# EAGLE design L3G6_PCB (EAGLE 9.2.0)
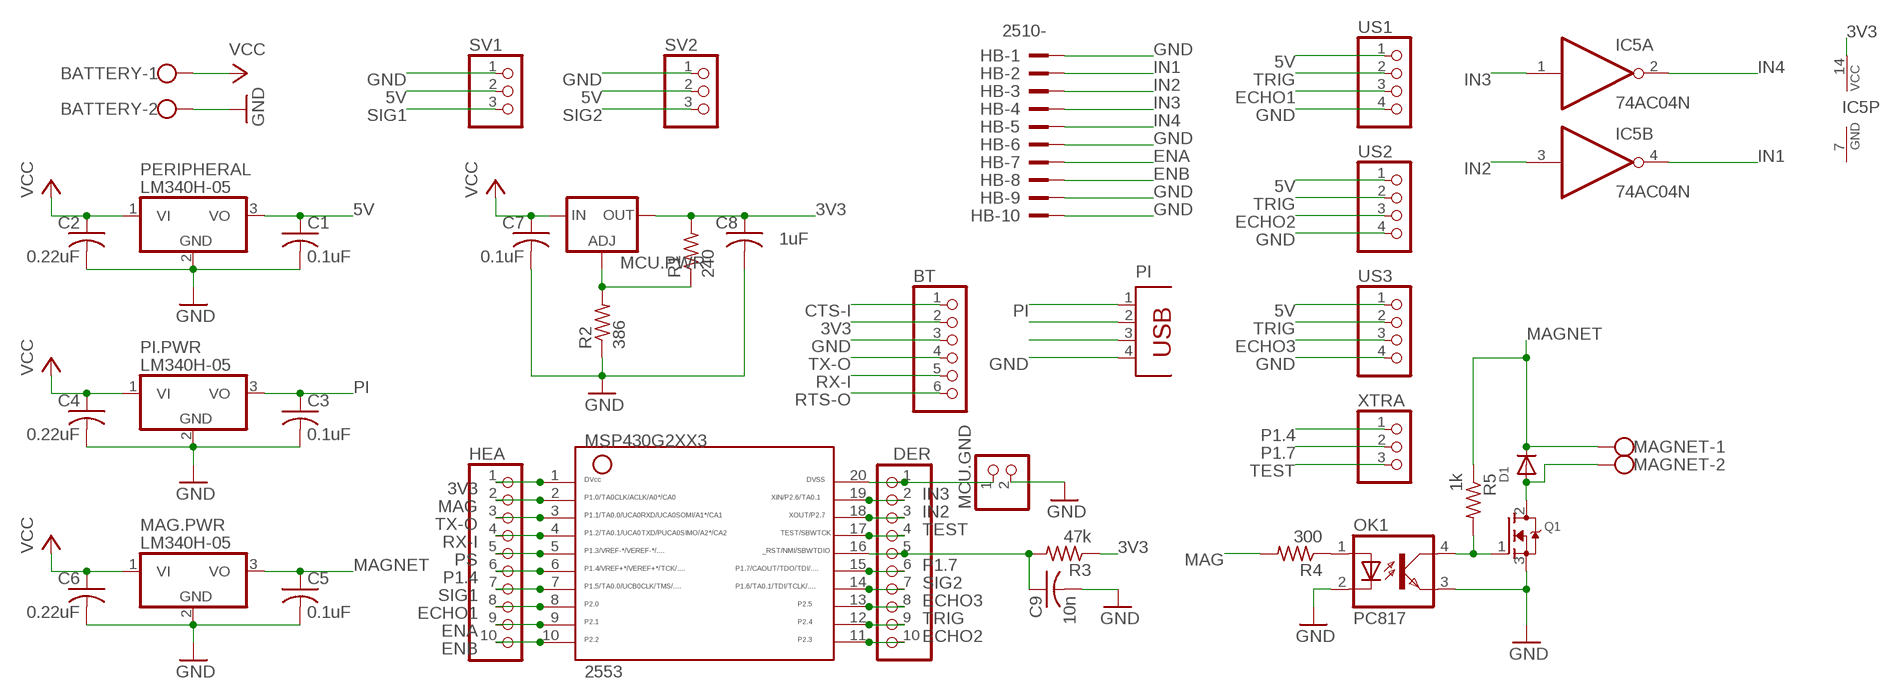
[diagram p0: schematic, sheet 1]

## Parts
2553  G2XX3---N20  [N20]
BATTERY  W237-102  [W237-102]
BT  PINHD-1X6  [1X06]
C1  0.1uF  C-US050-025X075  [C050-025X075]
C2  0.22uF  C-US050-025X075  [C050-025X075]
C3  0.1uF  C-US050-025X075  [C050-025X075]
C4  0.22uF  C-US050-025X075  [C050-025X075]
C5  0.1uF  C-US050-025X075  [C050-025X075]
C6  0.22uF  C-US050-025X075  [C050-025X075]
C7  0.1uF  C-US050-025X075  [C050-025X075]
C8  1uF  C-US050-025X075  [C050-025X075]
C9  10n  C-US050-025X075  [C050-025X075]
D1  DIODEDO-1N4148  [DO-1N4148]
DER  PINHD-1X10  [1X10]
HB  2510-  [PAK100/2500-10]
HEA  PINHD-1X10  [1X10]
IC5  74AC04N  [DIL14]
MAG.PWR  LM340H-05  [TO220H]
MAGNET  W237-102  [W237-102]
MCU.GND  PINHD-1X2  [1X02]
MCU.PWR  LM317TS  [317TS]
OK1  PC817  [DIL04]
PERIPHERAL  LM340H-05  [TO220H]
PI  PN87520  [PN87520]
PI.PWR  LM340H-05  [TO220H]
Q1  MOSFET-NGDS_TO220V  [TO220V]
R1  240  R-US_0207/10  [0207/10]
R2  386  R-US_0207/10  [0207/10]
R3  47k  R-US_0207/10  [0207/10]
R4  300  R-US_0207/10  [0207/10]
R5  1k  R-US_0207/10  [0207/10]
SV1  PINHD-1X3  [1X03]
SV2  PINHD-1X3  [1X03]
US1  PINHD-1X4  [1X04]
US2  PINHD-1X4  [1X04]
US3  PINHD-1X4  [1X04]
XTRA  PINHD-1X3  [1X03]

## Nets
3V3: 2553.1 BT.2 C8.1 HEA.1 IC5.14(P:VCC) MCU.PWR.2(OUT) R1.2 R3.1
5V: C1.1 PERIPHERAL.3(VO) SV1.2 SV2.2 US1.1 US2.1 US3.1
CTS-I: BT.1
ECHO1: 2553.8 HEA.8 US1.3
ECHO2: 2553.11 DER.10 US2.3
ECHO3: 2553.13 DER.8 US3.3
ENA: 2553.9 HB.7 HEA.9
ENB: 2553.10 HB.8 HEA.10
GND: BATTERY.2 BT.3 C1.2 C2.2 C3.2 C4.2 C5.2 C6.2 C7.2 C8.2 C9.2 HB.1 HB.6 HB.9 HB.10 MAG.PWR.2(GND) MCU.GND.2 OK1.2(C) OK1.3(EMIT) PERIPHERAL.2(GND) PI.4 PI.PWR.2(GND) Q1.3(S) R2.1 SV1.1 SV2.1 US1.4 US2.4 US3.4
IN1: HB.2 IC5.4(B:O)
IN2: 2553.18 DER.3 HB.3 IC5.3(B:I)
IN3: 2553.19 DER.2 HB.4 IC5.1(A:I)
IN4: HB.5 IC5.2(A:O)
MAG: 2553.2 HEA.2 R4.2
MAGNET: C5.1 D1.C MAG.PWR.3(VO) MAGNET.1 R5.1
N$1: 2553.16 C9.1 DER.5 R3.2
N$2: MCU.PWR.1(ADJ) R1.1 R2.2
N$3: OK1.1(A) R4.1
N$4: PI.2
N$5: PI.3
N$6: 2553.20 DER.1 MCU.GND.1
N$7: D1.A MAGNET.2 Q1.2(D)
N$8: OK1.4(COL) Q1.1(G) R5.2
P1.4: 2553.6 HEA.6 XTRA.1
P1.7: 2553.15 DER.6 XTRA.2
PI: C3.1 PI.1 PI.PWR.3(VO)
PS: 2553.5 HEA.5
RTS-O: BT.6
RX-I: 2553.4 BT.5 HEA.4
SIG1: 2553.7 HEA.7 SV1.3
SIG2: 2553.14 DER.7 SV2.3
TEST: 2553.17 DER.4 XTRA.3
TRIG: 2553.12 DER.9 US1.2 US2.2 US3.2
TX-O: 2553.3 BT.4 HEA.3
VCC: BATTERY.1 C2.1 C4.1 C6.1 C7.1 MAG.PWR.1(VI) MCU.PWR.3(IN) PERIPHERAL.1(VI) PI.PWR.1(VI)
Unconnected: IC5.5(C:I) IC5.6(C:O) IC5.8(D:O) IC5.9(D:I) IC5.10(E:O) IC5.11(E:I) IC5.12(F:O) IC5.13(F:I)

## Power pins joined to a net without a drawn wire
GND: IC5.7(P:GND)

## Library data of the parts
2553 = TI_MSP430_v16:G2XX3---N20: MSP430G2XX1 PDIP (N) 20 Pin Package
BATTERY MAGNET = con-wago-500:W237-102: WAGO SCREW CLAMP; MPN: 237-102; OC_FARNELL: unknown; OC_NEWARK: 70K9898
BT = pinhead:PINHD-1X6: PIN HEADER
C1-C9 = resistor:C-US: CAPACITOR, American symbol
D1 = adafruit:DIODE: Diode SMADIODE - SMA Surface Mount Package 20V 1A Schottky Diode Digikey: 641-1014-6-ND DO-1N4148 - Through Hole Small Current Diode SOD-123 20V 1 A (.5mV Vf) Schottky Diode - Digikey: MBRX120TPMSCT-ND SOD-323 10V 570mA (.38mV Vf, 3ns) Schottky Diode - Digikey: ZLLS410CT-ND SOD-523 30V 30mA Schottky Diode (RB751S-40TE61) - Digikey: RB751S-40TE61CT-ND SOT23-R/W - SOT23 Package (R = Solder Paste/Reflow Ovens, W = Hand-Soldering) BAT54Film 40V 300mA - Digikey: 497-7162-1-ND
DER HEA = pinhead:PINHD-1X10: PIN HEADER
HB = con-3m:2510-: 3M (TM) Pak 100 4-Wall Header Source: 3M; MF: 3M; MPN: 2510-6002UB; OC_FARNELL: 9838244; OC_NEWARK: 46F4725
IC5 = 74xx-eu:74*04: Hex INVERTER
MAG.PWR PERIPHERAL PI.PWR = linear:LM340?-*: Positive VOLTAGE REGULATOR Source: http://cache.national.com/ds/LM/LM340.pdf
MCU.GND = pinhead:PINHD-1X2: PIN HEADER
MCU.PWR = v-reg:LM317TS: VOLTAGE REGULATOR
OK1 = optocoupler:PC817: SHARP OPTO COUPLER; MPN: PC817X4J000F; OC_FARNELL: 9707727; OC_NEWARK: 97K7059
PI = con-berg:PN87520: BERG USB connector; OC_FARNELL: unknown; OC_NEWARK: unknown
Q1 = adafruit:MOSFET-N: N-Channel Mosfet 2N7002E - 60V 260mA SOT23 [Digikey: 2N7002ET1GOSTR-ND] - REEL BSH103 - 30V 850mA SOT23 [Digikey: 568-5013-1-ND]
R1-R4 = adafruit:R-US_: RESISTOR, American symbol
R5 = adafruit:R-US_: RESISTOR, American symbol; SPICEPREFIX: R
SV1 SV2 XTRA = pinhead:PINHD-1X3: PIN HEADER
US1-US3 = pinhead:PINHD-1X4: PIN HEADER

## Board
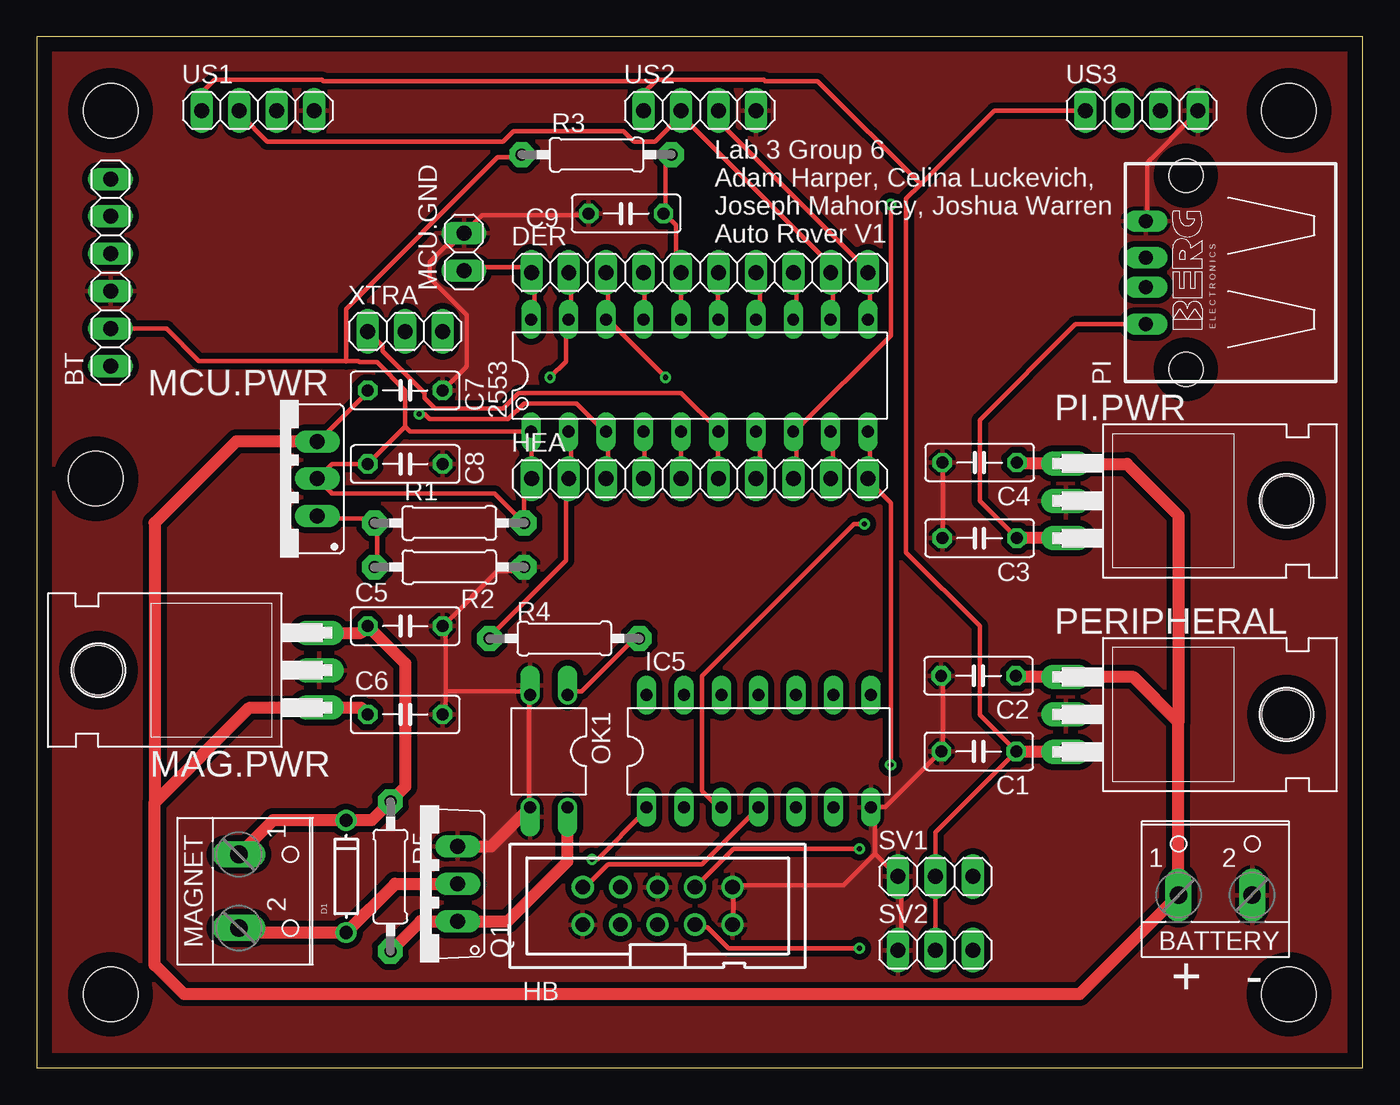
[diagram p1: board, top side]
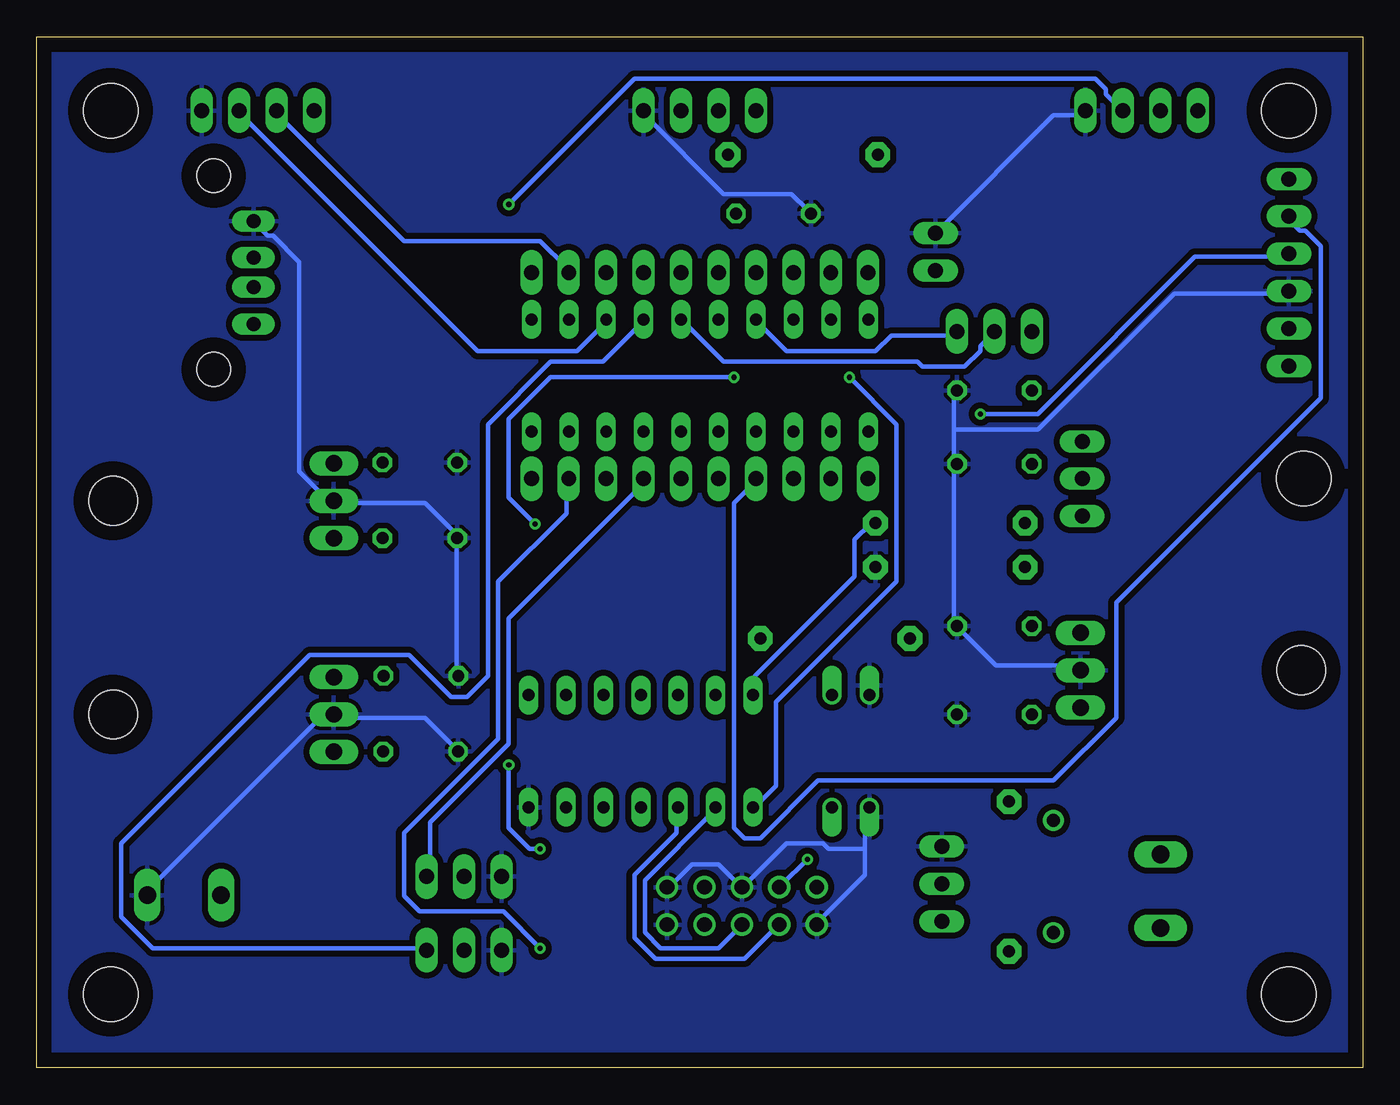
[diagram p2: board, bottom side, seen from below]

Size 90 x 70 mm. Coordinates in mm from the lower left corner, seen from the top.
Outline: 0,0 90,0 90,70 0,70 0,0
Copper layers (1*16): Top 0.035mm / dielectric 1.5mm / Bottom 0.035mm
Design rules "default *": minimum track width 12mil, minimum drill 0.35mm, track to track 16mil, track to pad 16mil, pad to pad 16mil, via to via 16mil, smd to smd 6mil, copper to edge 40mil, drill to drill 6mil, minimum pad ring 10mil, minimum via ring 8mil, stop-mask expansion 4mil, vias tented up to drill 0mil, thermal gap 10mil
Holes 3.7 mm at 5,65 85,65 5,5 85,5 4,40

### Footprints (pad centres in the part's own frame; a part is rotated, then mirrored left to right if it is on the bottom)
N20 = drill 0.813 long: 1 -11.435,-3.81; 2 -8.895,-3.81; 3 -6.355,-3.81; 4 -3.815,-3.81; 5 -1.275,-3.81; 6 1.265,-3.81; 7 3.805,-3.81; 8 6.345,-3.81; 9 8.885,-3.81; 10 11.425,-3.81; 11 11.425,3.81; 12 8.885,3.81; 13 6.345,3.81; 14 3.805,3.81; 15 1.265,3.81; 16 -1.275,3.81; 17 -3.815,3.81; 18 -6.355,3.81; 19 -8.895,3.81; 20 -11.435,3.81
W237-102 = drill 1.194 long: 1 -2.5,-1.27; 2 2.5,-1.27
1X06 = drill 1.016 long: 1 -6.35,0; 2 -3.81,0; 3 -1.27,0; 4 1.27,0; 5 3.81,0; 6 6.35,0
C050-025X075 = drill 0.813 octagon: 1 -2.54,0; 2 2.54,0
DO-1N4148 = drill 0.9: A -3.81,0; C 3.81,0
1X10 = drill 1.016 long: 1 -11.43,0; 2 -8.89,0; 3 -6.35,0; 4 -3.81,0; 5 -1.27,0; 6 1.27,0; 7 3.81,0; 8 6.35,0; 9 8.89,0; 10 11.43,0
PAK100/2500-10 = drill 1 pad 1.422: 1 -5.08,-1.27; 2 -5.08,1.27; 3 -2.54,-1.27; 4 -2.54,1.27; 5 0,-1.27; 6 0,1.27; 7 2.54,-1.27; 8 2.54,1.27; 9 5.08,-1.27; 10 5.08,1.27
DIL14 = drill 0.813 long: 1 -7.62,-3.81; 2 -5.08,-3.81; 3 -2.54,-3.81; 4 0,-3.81; 5 2.54,-3.81; 6 5.08,-3.81; 7 7.62,-3.81; 8 7.62,3.81; 9 5.08,3.81; 10 2.54,3.81; 11 0,3.81; 12 -2.54,3.81; 13 -5.08,3.81; 14 -7.62,3.81
TO220H = drill 1.118 long: 1 -2.54,-10.16; 2 0,-10.16; 3 2.54,-10.16 | hole 3.302: 0,4.826
1X02 = drill 1.016 long: 1 -1.27,0; 2 1.27,0
317TS = drill 1.016 long: 1 -2.54,-2.54; 2 0,-2.54; 3 2.54,-2.54
DIL04 = drill 0.813 offset: 1 -1.27,-3.81; 2 1.27,-3.81; 3 1.27,3.81; 4 -1.27,3.81
PN87520 = drill 0.95 long: 1 -3.5,2.71; 2 -1,2.71; 3 1,2.71; 4 3.5,2.71 | hole 2.3: -6.57,0; 6.57,0
TO220V = drill 1.016 long: 1 -2.54,-2.54; 2 0,-2.54; 3 2.54,-2.54
0207/10 = drill 0.813 pad 1.676 octagon: 1 -5.08,0; 2 5.08,0
1X03 = drill 1.016 long: 1 -2.54,0; 2 0,0; 3 2.54,0
1X04 = drill 1.016 long: 1 -3.81,0; 2 -1.27,0; 3 1.27,0; 4 3.81,0

### Placement (x,y rotation side)
2553  45,47 0 top
BATTERY  80,13 0 top
BT  5,54 90 top
C1  63.94,21.48 180 top
C2  63.93,26.62 180 top
C3  64,35.96 180 top
C4  64,41.1 180 top
C5  25,30 0 top
C6  25,24 0 top
C7  25,46 0 top
C8  25,41 0 top
C9  40,58 180 top
D1  21,13 90 top
DER  45,54 0 top
HB  42.14,11 0 top
HEA  45,40 0 top
IC5  49,21.5 0 top
MAG.PWR  9,27 90 top
MAGNET  15,12 270 top
MCU.GND  29,55.4 90 top
MCU.PWR  16.5,40 90 top
OK1  34.75,21.5 180 top
PERIPHERAL  80,24 270 top
PI  78,54 90 top
PI.PWR  80,38.5 270 top
Q1  26.03,12.5 90 top
R1  28,37 0 top
R2  28,34 180 top
R3  38,62 0 top
R4  35.81,29.15 180 top
R5  24,13 270 top
SV1  61,13 0 top
SV2  61,8 0 top
US1  15,65 0 top
US2  45,65 0 top
US3  75,65 0 top
XTRA  25,50 0 top

### Tracks (layer width: path | path; a pad name or v marks a point on that pad's centre or on a via)
3V3
  Top 0.305: 25,43.54 C8.1 20.04,41 MCU.PWR.2 20,39.04 20,39 31.08,39 R1.2 33.08,39.51 HEA.1 2553.1 25.35,43.19 25,43.54 | 25,43.54 25,46 23.08,47.92 21.91,47.92 21.83,48 20.98,48 | 20.98,48 11,48 8.81,50.19 BT.2 | 20.98,48 20.98,51.51 31.29,61.82 32.72,61.82 R3.1 | 20.98,47.95 20.98,48
  Bottom 0.305: IC5.14 41.25,25.55 41.25,26.62 34.49,33.37 34.49,35.86 33.43,36.93 R1.2
5V
  Top 0.305: 60,60 59,59 59,35 64,30 64,23.97 C1.1 61,16 SV1.2 SV2.2 | 60,60 65,65 US3.1 | US2.1 41.19,66.19 42,67 | 60,60 53,67 49.44,67 49.36,67.08 42.08,67.08 42,67 | US1.1 11.19,66.19 12.08,67.08 19.36,67.08 19.44,67 42,67
  Top 0.813: PERIPHERAL.3 66.51,21.46 C1.1
ECHO1  (via drill 0.35)
  Top 0.305: HEA.8 51.56,40.13 51.56,42.97 2553.8 51.56,43.33 57.96,49.73 v57.96,58.62
  Bottom 0.305: v57.96,58.62 49.43,67.16 18.14,67.16 17.42,66.44 17.42,66.09 16.36,65.02 US1.3
ECHO2
  Top 0.305: 2553.11 56.54,51.15 56.54,54 DER.10 56.19,54.35 46.58,63.95 46.58,64.67 US2.3
ECHO3
  Top 0.305: 2553.13 51.56,51.15 51.56,54 DER.8
  Bottom 0.305: US3.3 76.1,64.67 60.1,48.66 53.34,48.66 51.21,50.8 2553.13
ENA  (via drill 0.35)
  Top 0.305: 2553.9 54.05,42.97 54.05,40.13 HEA.9 | v55.83,8.13 46.94,8.13 45.52,9.55 44.81,9.55 HB.7
  Bottom 0.305: v55.83,8.13 58.32,10.62 64.01,10.62 65.08,11.68 65.08,15.95 58.67,22.35 58.67,33.02 54.05,37.64 54.05,39.77 HEA.9
ENB  (via drill 0.35)
  Top 0.305: 2553.10 56.54,42.97 56.54,40.13 HEA.10 56.54,39.77 57.96,38.35 v57.96,20.57 | v55.83,14.88 47.3,14.88 44.81,12.39 HB.8
  Bottom 0.305: v55.83,14.88 56.54,14.88 57.96,16.3 v57.96,20.57
GND
  Top 0.305: 56.9,14.53 56.9,17.37 IC5.7 56.9,17.73 57.61,17.73 61.16,21.28 C1.2 61.52,21.64 61.52,26.62 C2.2 | 56.9,14.53 58.32,13.1 SV1.1 58.67,12.75 58.67,8.13 SV2.1 | PI.4 75.39,57.55 75.39,61.47 78.59,64.67 US3.4 | C3.2 61.52,36.22 61.52,40.84 C4.2 | C9.2 37.34,57.91 30.23,57.91 29.16,56.84 MCU.GND.2 28.8,56.49 28.09,55.78 27.74,55.78 26.67,54.71 26.67,53.64 29.16,51.15 29.16,47.6 27.74,46.17 C7.2 | HB.9 47.3,9.9 47.3,12.04 HB.10 47.3,12.39 54.76,12.39 56.9,14.53 | 27.74,25.55 27.74,29.82 C5.2 27.74,30.17 31.29,33.73 33.07,33.73 R2.1 | 27.74,25.55 27.74,24.13 C6.2 | 27.74,25.55 33.43,25.55 OK1.2 33.43,25.19 33.43,18.08 OK1.3
  Top 0.813: Q1.3 30.83,15.04 OK1.3
  Bottom 0.305: C1.2 61.52,21.64 63.65,23.77 69.7,23.77 PERIPHERAL.2 70.05,23.77 70.76,23.77 82.5,12.04 BATTERY.2 | PI.4 75.03,57.2 74.32,56.49 73.97,56.49 72.19,54.71 72.19,40.48 70.05,38.35 PI.PWR.2 69.7,38.35 63.65,38.35 61.52,36.22 C3.2 61.52,35.86 61.52,26.97 C2.2 | US1.4 18.85,64.67 20.98,64.67 28.8,56.84 MCU.GND.2 | US2.4 48.72,64.67 43.38,59.33 38.76,59.33 37.69,58.27 C9.2 | 27.74,43.33 27.74,45.82 C7.2 | 27.74,43.33 27.74,41.2 C8.2 27.74,40.84 27.74,30.17 C5.2 27.38,29.82 24.89,27.33 19.2,27.33 MAG.PWR.2 | 27.74,43.33 22.05,43.33 12.8,52.58 5.33,52.58 BT.3 | HB.10 46.94,12.39 45.52,13.81 43.74,13.81 42.32,12.39 HB.6 41.96,12.39 39.12,15.24 36.63,15.24 36.27,14.88 33.78,14.88 | 33.78,14.88 33.78,17.37 OK1.3 | 33.78,14.88 33.78,13.1 36.98,9.9 HB.1
  pour Top: -4,73 94,73 94,-5 -4,-5
  pour Bottom: -4,73 94,73 94,-5 -4,-5
IN1
  Top 0.305: IC5.4 48.72,17.37 45.16,13.81 38.76,13.81 37.34,12.39 HB.2
IN2  (via drill 0.35)
  Top 0.305: DER.3 38.76,54 38.76,51.15 2553.18 38.76,50.8 v42.67,46.89 | v56.19,36.93 55.47,36.93 45.16,26.62 45.16,18.79 46.23,17.73 IC5.3
  Bottom 0.305: IC5.3 46.58,17.37 46.58,15.95 49.43,13.1 49.43,8.84 48.01,7.41 41.96,7.41 39.83,9.55 HB.3 | v42.67,46.89 55.12,46.89 57.96,44.04 57.96,38.71 v56.19,36.93
IN3  (via drill 0.35)
  Top 0.305: DER.2 36.27,54 36.27,51.15 2553.19 35.92,50.8 35.92,47.95 v34.85,46.89 | v37.69,14.17 38.05,14.17 41.25,17.37 IC5.1
  Bottom 0.305: v37.69,14.17 39.47,12.39 HB.4 | v34.85,46.89 31.65,43.69 31.65,33.02 39.83,24.84 39.83,19.15 41.25,17.73 IC5.1
IN4
  Bottom 0.305: IC5.2 44.09,17.37 48.72,12.75 48.72,9.19 47.65,8.13 43.74,8.13 42.32,9.55 HB.5
MAG
  Top 0.305: 2553.2 36.27,42.97 36.27,40.13 HEA.2 35.92,39.77 35.92,34.44 30.94,29.46 R4.2
MAGNET
  Top 0.813: MAG.PWR.3 22,29.54 C5.1 25,27.46 25,19.08 R5.1 22.73,16.81 D1.C 16.04,16.81 MAGNET.1
N$1
  Top 0.305: 2553.16 43.74,51.15 DER.5 43.38,54.35 43.38,57.2 42.67,57.91 C9.1 42.67,58.27 42.67,61.47 43.03,61.82 R3.2
N$2
  Top 0.305: MCU.PWR.1 19.2,37.28 22.76,37.28 R1.1 23.11,36.93 23.11,34.08 R2.2
N$3
  Top 0.305: OK1.1 36.27,25.55 36.98,25.55 40.54,29.11 R4.1
N$6
  Top 0.305: 2553.20 33.78,51.15 33.78,54 DER.1 33.43,54.35 29.16,54.35 MCU.GND.1
N$7
  Top 0.813: MAGNET.2 14.04,9.19 D1.A 24.31,12.5 Q1.2
N$8
  Top 0.813: R5.2 26.04,9.96 Q1.1 31.96,9.96 36.02,14.02 OK1.4
P1.4
  Top 0.305: HEA.6 46.23,40.13 46.23,42.97 2553.6 46.23,43.33 43.74,45.82 32.72,45.82 31.65,44.75 27.03,44.75 26.31,45.46 26.31,45.82 23.47,48.66 23.47,49.02 22.76,49.73 XTRA.1
P1.7
  Top 0.305: 2553.15 46.23,51.15 46.23,54 DER.6
  Bottom 0.305: XTRA.2 25.25,49.73 25.96,49.02 25.96,48.66 27.03,47.6 29.87,47.6 30.23,47.95 43.38,47.95 46.23,50.8 2553.15
PI
  Top 0.305: C3.1 64,38.5 64,44 70.5,50.5 PI.1
  Top 0.813: PI.PWR.3 C3.1
PS
  Top 0.305: 2553.5 43.74,42.97 43.74,40.13 HEA.5
RX-I
  Top 0.305: 2553.4 41.25,42.97 41.25,40.13 HEA.4
  Bottom 0.305: BT.5 4.98,57.55 4.27,56.84 3.91,56.84 2.85,55.78 2.85,45.46 16.71,31.59 16.71,23.77 20.98,19.51 36.98,19.51 40.89,15.59 41.96,15.59 42.67,16.3 42.67,38.35 41.25,39.77 HEA.4
SIG1
  Top 0.305: 2553.7 49.07,42.97 49.07,40.13 HEA.7
  Bottom 0.305: SV1.3 63.3,13.1 63.3,16.66 57.96,21.99 57.96,30.53 48.72,39.77 HEA.7
SIG2
  Top 0.305: 2553.14 49.07,51.15 49.07,54 DER.7
  Bottom 0.305: SV2.3 63.65,8.13 82.14,8.13 84.28,10.26 84.28,15.24 71.48,28.04 64.72,28.04 61.87,25.19 60.81,25.19 59.38,26.62 59.38,43.69 55.12,47.95 51.56,47.95 48.72,50.8 2553.14
TEST
  Top 0.305: 2553.17 41.25,51.15 41.25,54 DER.4
  Bottom 0.305: XTRA.3 27.74,49.73 32,49.73 33.07,48.66 39.12,48.66 41.25,50.8 2553.17
TRIG
  Top 0.305: 43.74,64.67 41.96,62.89 40.54,62.89 39.83,63.6 32.36,63.6 31.65,62.89 15.65,62.89 13.87,64.67 US1.2 | 2553.12 54.05,51.15 54.05,54 DER.9 54.05,54.35 43.74,64.67 | 43.74,64.67 US2.2
  Bottom 0.305: US3.2 73.61,64.67 65.08,56.13 55.83,56.13 54.05,54.35 DER.9
TX-O  (via drill 0.35)
  Top 0.305: HEA.3 38.76,40.13 38.76,42.97 2553.3 38.41,43.33 36.63,45.11 33.07,45.11 32,44.04 26.67,44.04 26.31,44.4 v25.96,44.4
  Bottom 0.305: v25.96,44.4 22.05,44.4 11.38,55.06 5.33,55.06 BT.4
VCC
  Top 0.305: C7.1 22.4,45.82 19.2,42.62 MCU.PWR.3
  Top 0.813: 77.5,23.5 BATTERY.1 70.77,5 10,5 8,7 8,18 | 77.5,23.5 74.46,26.54 PERIPHERAL.1 66.55,26.54 C2.1 | 77.5,23.5 77.5,37.5 74,41 69.88,41 PI.PWR.1 66.6,41.04 C4.1 | 8,18 14.46,24.46 MAG.PWR.1 22,24.46 C6.1 | MCU.PWR.3 13.54,42.54 8,37 8,18

### Text on the board
tPlace: Lab 3 Group 6 / Adam Harper, Celina Luckevich, / Joseph Mahoney, Joshua Warren / Auto Rover V1 | + -